# EasyEDA Pro project PRJ_Feeder.epro, board MainBoard
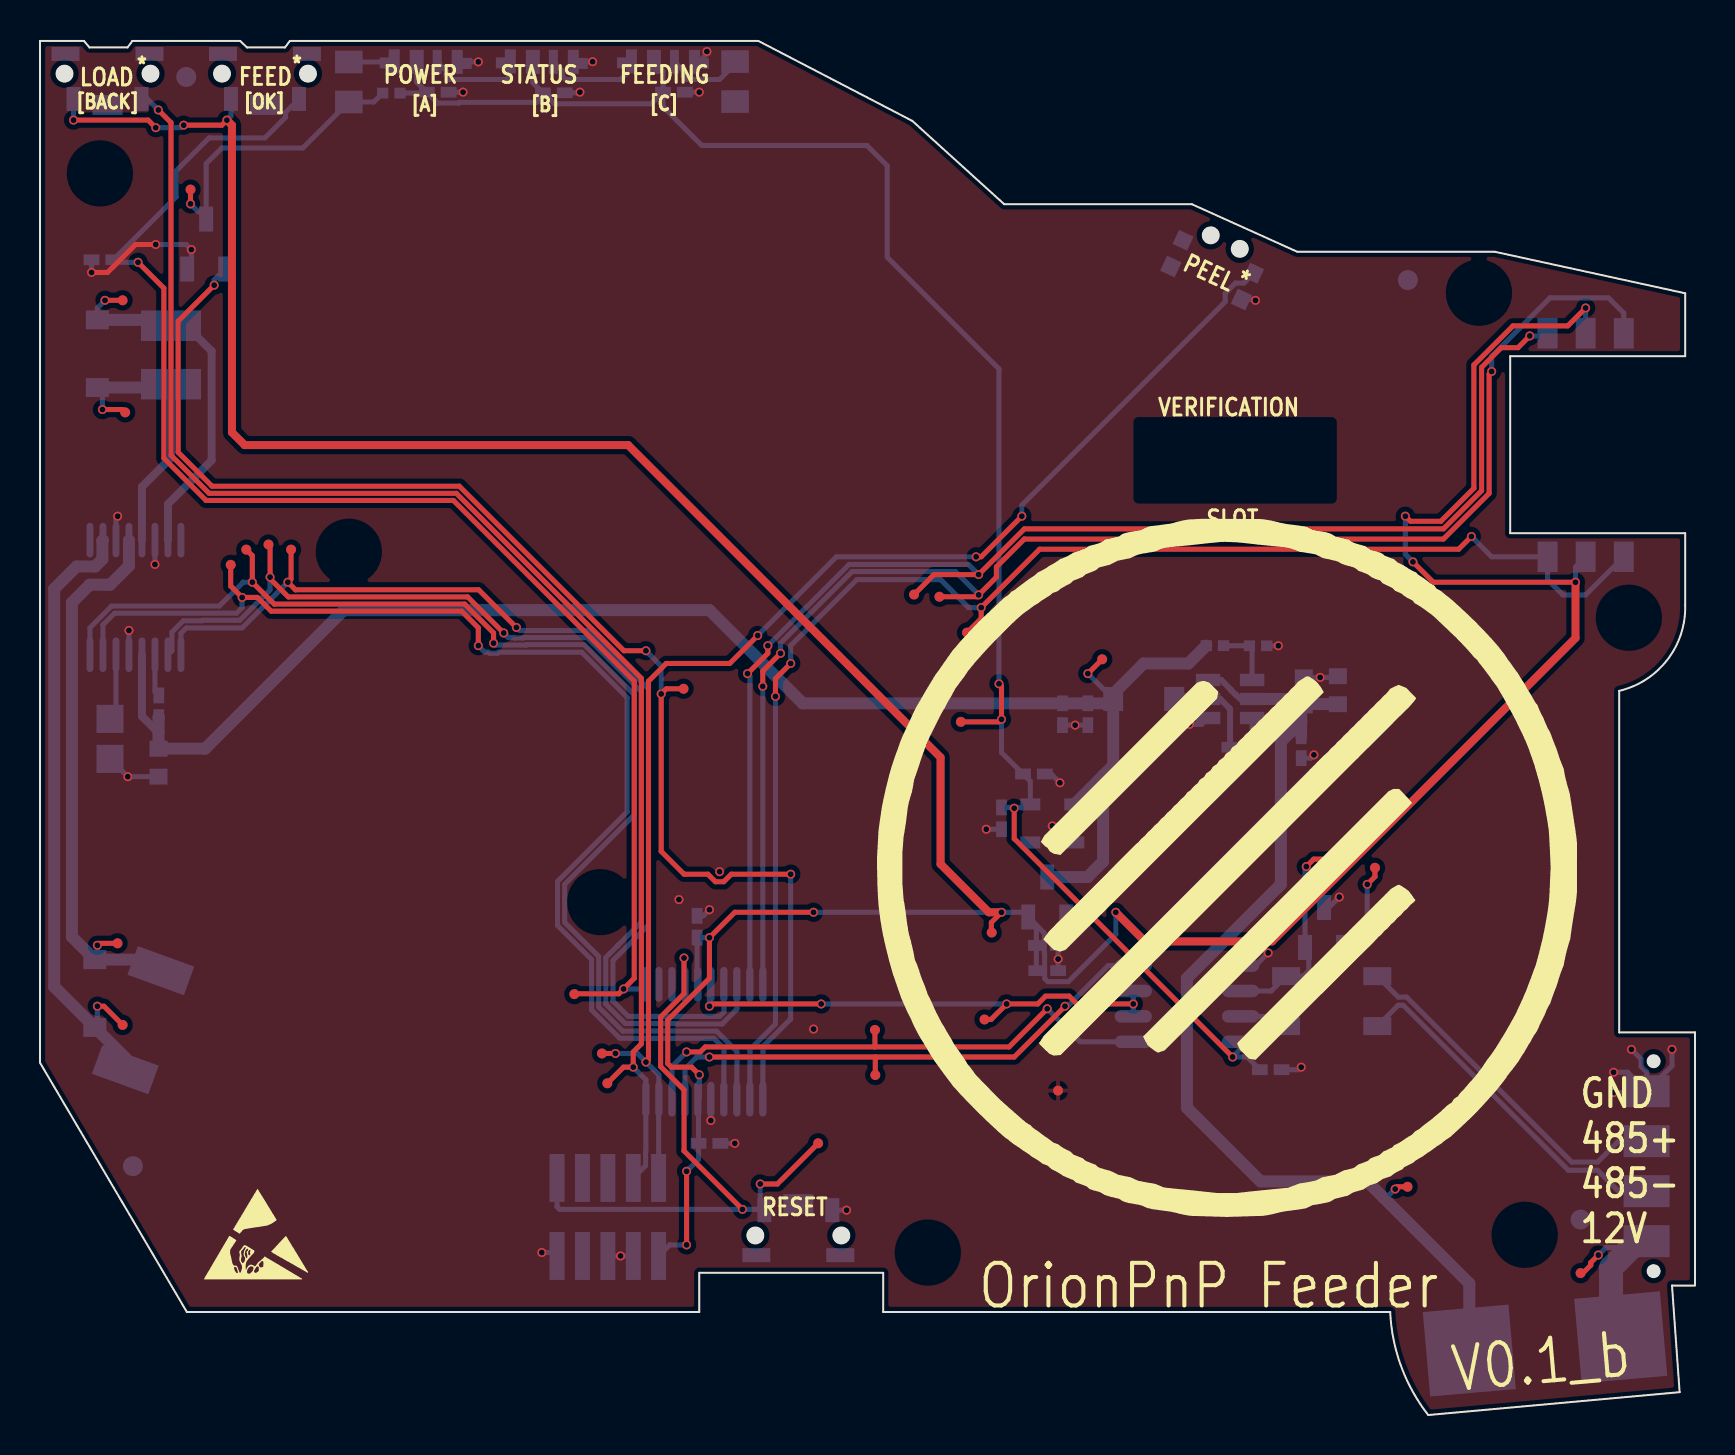
[diagram p10: board, top side]
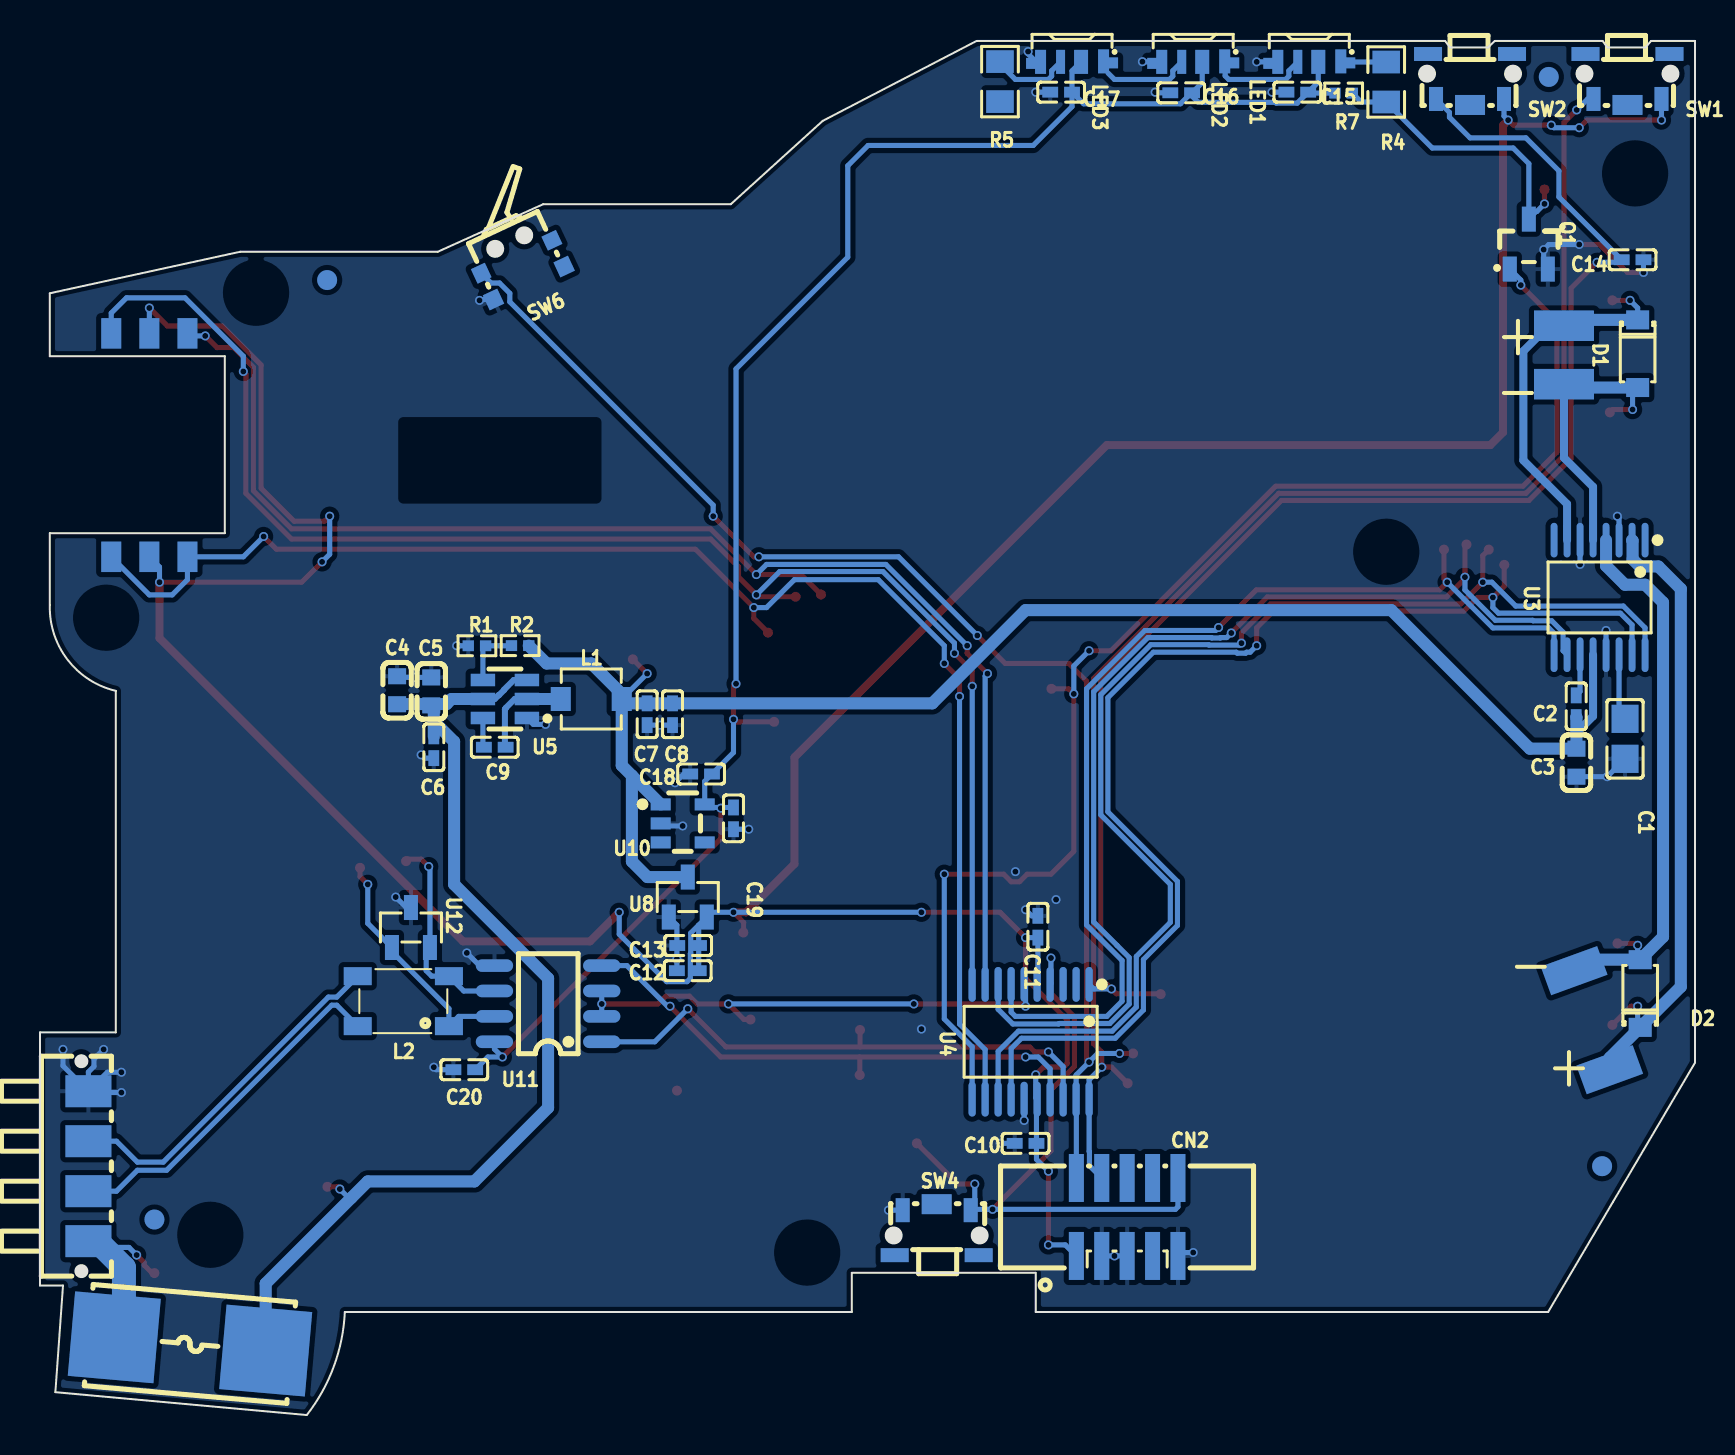
[diagram p11: board, bottom side, seen from below]

Outline 82.76 x 68.73 mm; copper layers: Top Layer, Bottom Layer. Coordinates in mm from the lower left corner of the outline.
Outline path: 0,68.73 0,17.62 4.09,10.67 7.34,5.15 32.97,5.15 32.97,7.11 42.16,7.11 42.16,5.15 67.52,5.15 arc(68.07,2.43) 69.42,0 81.99,1.14 81.61,6.48 82.76,6.48 82.76,19.14 78.97,19.14 78.97,36.22 arc(81.38,37.78) 82.27,40.51 82.27,44.11 73.52,44.11 73.52,52.96 82.27,52.96 82.27,56.11 72.74,58.18 62.87,58.18 57.6,60.56 48.22,60.56 43.62,64.73 35.92,68.73 12.49,68.73 12.25,68.4 10.35,68.4 10.01,68.73 4.62,68.73 4.38,68.4 2.48,68.4 2.2,68.73 0,68.73
Stack: Top Layer 0.035mm / Dielectric1 1.11mm FR4 er 4.5 / Bottom Layer 0.035mm

## Design rules (mm)
net 485-: DP1
net 485+: DP1
template: Custom Config
spacing copperThickness1oz (default): track to track 0.102, other pairs 0.152 to 0.3
spacing copperThickness2oz: track to track 0.203, other pairs 0.152 to 0.3
spacing PWR: track to track 0.3, other pairs 0.152 to 0.3
track width copperThickness1oz (default): min 0.127, default 0.254, max 2.54
track width copperThickness2oz: min 0.203, default 0.254, max 2.54
track width PWR: min 0.127, default 0.254, max 2.54
differential pair differentialPair (default): width min 0.127, default 0.254, max 2.54; gap min 0.152, default 0.152
via viaSize (default): diameter min 0.45, default 0.45, max 10; hole min 0.3, default 0.3, max 6.3
net 6V uses PWR
net DC_EN uses PWR
net DC_SW uses PWR
net VIN_RAW uses PWR
net M1- uses PWR
net M1+ uses PWR
net M2- uses PWR
net M2+ uses PWR

## Placement (name value [footprint] x y rotation side)
C1  2.2uF  [C0805]  3.5 33.82 90 bottom
C2  10nF  [C0402]  5.94 35.45 270 bottom
C3  10uF  [C0603]  5.93 32.63 270 bottom
C4  10uF  [C0603]  64.9 36.25 270 bottom
C5  10uF  [C0603]  63.19 36.2 270 bottom
C6  100nF  [C0402]  60.02 33.4 0 bottom
C7  22uF  [C0402]  52.4 35.05 90 bottom
C8  22uF  [C0402]  51.13 35.05 90 bottom
C9  100nF  [C0402]  63.07 33.4 270 bottom
C10  100nF  [C0402]  33.47 13.59 0 bottom
C11  100nF  [C0402]  32.86 24.42 90 bottom
C12  100nF  [C0402]  50.37 22.23 0 bottom
C13  4.7uF  [C0402]  50.35 23.48 180 bottom
C14  100nF  [C0402]  3.12 57.79 180 bottom
C15  100nF  [C0402]  19.89 66.17 0 bottom
C16  100nF  [C0402]  25.69 66.14 0 bottom
C17  100nF  [C0402]  31.7 66.17 0 bottom
C18  100nF  [C0402]  49.7 32.06 0 bottom
C19  4.7uF  [C0402]  48.08 29.85 90 bottom
C20  100nF  [C0402]  61.54 17.27 180 bottom
CN2  20021521-00010T1LF  [IDC-SMD_10P-P1.27_X1270WVS-2X05B-6TV01]  28.39 9.91 180 bottom
D1  1N4148W  [SOD-123_L2.8-W1.8-LS3.7-RD]  2.87 53.09 270 bottom
D2  1N4148W  [SOD-123_L2.8-W1.8-LS3.7-RD]  2.74 21.08 90 bottom
FH1  01550900M  [FUSE-SMD_L9.8-W5.0]  75.26 3.56 185 bottom
L1  1.5uH  [IND-SMD_L3.0-W3.0-LS3.65]  55.19 35.81 180 bottom
L2  ACT45B-510-2P-TL003  [IND-SMD_4P-L4.5-W3.2-TL]  64.59 20.7 0 bottom
LED1  SK6812SIDE-A-RVS  [LED-SMD_4P-L4.0-W1.6-L]  19.29 67.7 0 bottom
LED2  SK6812SIDE-A-RVS  [LED-SMD_4P-L4.0-W1.6-L]  25.09 67.7 0 bottom
LED3  SK6812SIDE-A-RVS  [LED-SMD_4P-L4.0-W1.6-L]  31.15 67.7 0 bottom
NOREF  -  [Pad_e195]  77.29 54.1 0 top
NOREF#2  -  [Pad_e190]  6.04 22.23 340 top
NOREF#3  -  [Pad_e192]  75.38 54.1 0 top
NOREF#4  -  [Pad_e194]  79.19 54.1 0 top
NOREF#5  -  [Pad_e198]  77.29 42.93 0 top
NOREF#6  -  [Pad_e196]  75.38 42.93 0 top
NOREF#7  -  [Pad_e188]  6.55 51.56 0 top
NOREF#8  -  [Pad_e191]  4.27 17.27 340 top
NOREF#9  -  [Pad_e187]  6.55 54.48 0 top
NOREF#10  -  [Pad_e197]  79.19 42.93 0 top
Q1  MDD3400  [SOT-23-3_L2.9-W1.5-P1.90-LS2.6-BR]  8.31 58.57 270 bottom
R1  10kΩ  [R0402]  60.91 38.48 180 bottom
R2  90.9kΩ  [R0402]  58.75 38.48 180 bottom
R4  470Ω  [R0805]  15.44 66.68 90 bottom
R5  470Ω  [R0805]  34.75 66.7 270 bottom
R7  10kΩ  [R0402]  17.57 66.12 180 bottom
SW1  1TS003A-2500-3500A-CT  [SW-SMD_1TS003A-XXXX-3500A-CT]  3.38 66.8 0 bottom
SW2  1TS003A-2500-3500A-CT  [SW-SMD_1TS003A-XXXX-3500A-CT]  11.25 66.8 0 bottom
SW4  1TS003A-2500-3500A-CT  [SW-SMD_1TS003A-XXXX-3500A-CT]  37.92 9.27 180 bottom
SW6  SPVN310101  [SW-SMD_SPVN310101]  58.62 57.28 155 bottom
TP1  -  [Test-Point-0.5mm]  50.91 16.23 0 top
TP2  -  [Test-Point-0.5mm]  47.59 24.13 0 top
TP3  -  [Test-Point-0.5mm]  77.04 7.1 0 top
TP4  -  [Test-Point-0.5mm]  68.38 11.42 0 top
TP5  -  [Test-Point-0.5mm]  46.05 34.67 0 top
TP6  -  [Test-Point-0.5mm]  53.11 37.8 0 top
TP8  -  [Test-Point-0.5mm]  28.1 18.08 0 top
TP9  -  [Test-Point-0.5mm]  38.91 13.59 0 top
TP10  -  [Test-Point-0.5mm]  26.72 21.05 0 top
TP11  -  [Test-Point-0.5mm]  28.37 16.59 0 top
TP12  -  [Test-Point-0.5mm]  66.76 27.37 0 top
TP13  -  [Test-Point-0.5mm]  64.45 27.71 0 top
TP14  -  [Test-Point-0.5mm]  41.75 19.26 0 top
TP15  -  [Test-Point-0.5mm]  47.23 19.78 0 top
TP16  -  [Test-Point-0.5mm]  41.77 17.01 0 top
TP17  -  [Test-Point-0.5mm]  32.18 36.33 0 top
TP18  -  [Test-Point-0.5mm]  7.53 61.3 0 top
TP19  -  [Test-Point-0.5mm]  4.13 55.76 0 top
TP20  -  [Test-Point-0.5mm]  4.26 50.15 0 top
TP21  -  [Test-Point-0.5mm]  3.88 23.59 0 top
TP22  -  [Test-Point-0.5mm]  4.13 19.51 0 top
TP23  -  [Test-Point-0.5mm]  10.31 43.29 270 top
TP24  -  [Test-Point-0.5mm]  9.54 42.52 270 top
TP25  -  [Test-Point-0.5mm]  11.43 43.54 270 top
TP26  -  [Test-Point-0.5mm]  12.55 43.29 270 top
TP27  -  [Test-Point-0.5mm]  44.98 40.93 0 top
TP28  -  [Test-Point-0.5mm]  43.71 41.04 0 top
TP29  -  [Test-Point-0.5mm]  46.36 39.13 0 top
U3  DRV8833PWR  [TSSOP-16_L5.0-W4.4-P0.65-LS6.4-BL]  4.77 40.89 0 bottom
U4  STM32F042F6P6TR  [TSSOP-20_L6.5-W4.4-P0.65-LS6.4-BL]  33.22 18.67 0 bottom
U5  TPS563249DDCR  [TSOT-23-6_L2.9-W1.6-P0.95-LS2.8-TL]  59.51 35.81 0 bottom
U8  XC6206P332MR  [SOT-23-3_L2.9-W1.3-P1.90-LS2.4-BR]  50.37 25.91 270 bottom
U9  YZ165615055F-04025-01  [CONN-SMD_4P-L11.0-W5.5-P2.50_YZ165615055F-04025-01]  80.34 12.45 90 bottom
U10  TPS7A2050PDBVR  [SOT-23-5_L2.9-W1.6-P0.95-LS2.8-BR]  50.62 29.59 0 bottom
U11  MAX1487EDTR(XBLW)  [SOP-8_L4.9-W3.9-P1.27-LS6.0-BL]  57.35 20.57 90 bottom
U12  PESD2CAN-ES  [SOT-23-3_L2.9-W1.3-P1.90-LS2.4-BR]  64.21 24.38 270 bottom
U13  -  [FIDUCIAL_1MM]  68.4 56.77 180 bottom
U13#2  -  [FIDUCIAL_1MM]  7.31 66.93 180 bottom
U13#3  -  [FIDUCIAL_1MM]  4.65 12.45 180 bottom
U13#4  -  [FIDUCIAL_1MM]  77.04 9.78 180 bottom

## Footprints (pads in the part's own frame, mm; a bottom-side part is the same pattern mirrored in y, then rotated)
C0402
  rect 0.79x0.54 smd: 1(-0.545,0) 2(0.545,0)
C0603
  rect 0.8x0.9 smd: 1(-0.7,0) 2(0.7,0)
C0805
  rect 1.41x1.35 smd: 1(-1,0) 2(1,0)
CONN-SMD_4P-L11.0-W5.5-P2.50_YZ165615055F-04025-01
  rect 1.6x2.3 smd: 1(-3.75,0) 2(-1.25,0) 3(1.25,0) 4(3.75,0)
FIDUCIAL_1MM
  round 1 smd: 1(0,0)
FUSE-SMD_L9.8-W5.0
  rect 4.3x4.24 smd: 1(-3.8,0) 2(3.8,0)
IDC-SMD_10P-P1.27_X1270WVS-2X05B-6TV01
  rect 0.75x2.4 smd: 1(-2.54,-1.95) 2(-2.54,1.95) 3(-1.27,-1.95) 4(-1.27,1.95) 5(0,-1.95) 6(0,1.95) 7(1.27,-1.95) 8(1.27,1.95) 9(2.54,-1.95) 10(2.54,1.95)
IND-SMD_4P-L4.5-W3.2-TL
  rect 1.4x0.9 smd: 1(-2.28,1.25) 2(-2.28,-1.25) 3(2.28,-1.25) 4(2.28,1.25)
IND-SMD_L3.0-W3.0-LS3.65
  rect 1x1.2 smd: 1(-1.524,0) 2(1.524,0)
LED-SMD_4P-L4.0-W1.6-L
  custom 1x1.2 smd: 1(-1.8,-0.013) 4(1.8,0.013)
  custom 0.7x1.2 smd: 2(-0.45,0.013)
  custom 0.45x1.2 smd: 3(0.575,0.013)
Pad_e187
  rect 3x1.524 smd far side: 1(0,0)
Pad_e188
  rect 3x1.524 smd far side: 2(0,0)
Pad_e190
  rect 3x1.524 smd far side: 2(0,0)
Pad_e191
  rect 3x1.524 smd far side: 1(0,0)
Pad_e192
  rect 1x1.524 smd far side: 1(0,0)
Pad_e194
  rect 1x1.524 smd far side: 1(0,0)
Pad_e195
  rect 1x1.524 smd far side: 1(0,0)
Pad_e196
  rect 1x1.524 smd far side: 1(0,0)
Pad_e197
  rect 1x1.524 smd far side: 1(0,0)
Pad_e198
  rect 1x1.524 smd far side: 1(0,0)
R0402
  rect 0.566x0.54 smd: 1(-0.433,0) 2(0.433,0)
R0805
  rect 1.133x1.377 smd: 1(-1,0) 2(1,0)
SOD-123_L2.8-W1.8-LS3.7-RD
  rect 0.95x1.15 smd: 1(-1.692,0) 2(1.692,0)
SOP-8_L4.9-W3.9-P1.27-LS6.0-BL
  oval 0.63x1.865 smd: 1(-1.905,-2.683) 2(-0.635,-2.683) 3(0.635,-2.683) 4(1.905,-2.683) 5(1.905,2.683) 6(0.635,2.683) 7(-0.635,2.683) 8(-1.905,2.683)
SOT-23-3_L2.9-W1.3-P1.90-LS2.4-BR
  rect 1.25x0.7 smd: 1(1,-0.95) 2(1,0.95) 3(-1,0)
SOT-23-3_L2.9-W1.5-P1.90-LS2.6-BR
  rect 1.25x0.7 smd: 1(1.25,-0.95) 2(1.25,0.95) 3(-1.25,0)
SOT-23-5_L2.9-W1.6-P0.95-LS2.8-BR
  rect 1x0.6 smd: 1(1.1,-0.95) 2(1.1,0) 3(1.1,0.95) 4(-1.1,0.95) 5(-1.1,-0.95)
SW-SMD_1TS003A-XXXX-3500A-CT
  rect 1.5x1 smd: 3(0,1.275)
  rect 1.4x0.7 smd: 4(-2.1,-1.275) 5(2.1,-1.275)
  rect 0.7x1.2 smd: A(1.7,0.975) B(-1.7,0.975)
SW-SMD_SPVN310101
  rect 0.77x0.8 smd: 1(-1.95,0.725)
  rect 0.8x0.83 smd: 2(-1.95,-0.725) 3(1.95,-0.725)
  rect 0.8x0.77 smd: 4(1.95,0.725)
Test-Point-0.5mm
  round 0.5 smd: 1(0,0)
TSOT-23-6_L2.9-W1.6-P0.95-LS2.8-TL
  rect 1.219x0.623 smd: 1(-1.1,0.95) 2(-1.1,0) 3(-1.1,-0.95) 4(1.1,-0.95) 5(1.1,0) 6(1.1,0.95)
TSSOP-16_L5.0-W4.4-P0.65-LS6.4-BL
  oval 0.343x1.732 smd: 1(-2.275,-2.866) 2(-1.625,-2.866) 3(-0.975,-2.866) 4(-0.325,-2.866) 5(0.325,-2.866) 6(0.975,-2.866) 7(1.625,-2.866) 8(2.275,-2.866) 9(2.275,2.866) 10(1.625,2.866) 11(0.975,2.866) 12(0.325,2.866) 13(-0.325,2.866) 14(-0.975,2.866) 15(-1.625,2.866) 16(-2.275,2.866)
TSSOP-20_L6.5-W4.4-P0.65-LS6.4-BL
  oval 0.364x1.742 smd: 1(-2.925,-2.871) 2(-2.275,-2.871) 3(-1.625,-2.871) 4(-0.975,-2.871) 5(-0.325,-2.871) 6(0.325,-2.871) 7(0.975,-2.871) 8(1.625,-2.871) 9(2.275,-2.871) 10(2.925,-2.871) 11(2.925,2.871) 12(2.275,2.871) 13(1.625,2.871) 14(0.975,2.871) 15(0.325,2.871) 16(-0.325,2.871) 17(-0.975,2.871) 18(-1.625,2.871) 19(-2.275,2.871) 20(-2.925,2.871)

## Nets
As in the schematic, except:
3V3: C10.1 C11.1 C12.1 C13.2 CN2.1 NOREF.1 NOREF#5.1 SW1.B SW2.B TP2.1 U4.5 U4.16 U8.2
IR_IN1: NOREF#3.1 TP28.1 U4.9
IR_IN2: NOREF#4.1 TP27.1 U4.10
IR_OUT: NOREF#6.1 NOREF#10.1 TP29.1 U4.12
M1+: D2.1 NOREF#8.1 TP22.1 U3.2
M1-: D2.2 NOREF#2.2 TP21.1 U3.4
M2+: D1.1 NOREF#9.1 TP19.1 U3.7
M2-: D1.2 NOREF#7.2 TP20.1 U3.5

Pads without a net: CN2 7 8; R5 2; SW1 3 4 5; SW2 3 4 5; SW4 3 4 5; SW6 3 4; U4 2 3; U10 3 4; U13 1; U13#2 1; U13#3 1; U13#4 1

## Via types
v1: diameter 0.45, hole 0.3, Top Layer to Bottom Layer, 112 vias

## Routing (per net, layer and track width the routed paths; a pad name or vN(x,y) marks a point on that pad's centre or on a via; arc(x,y) is an arc through that point)
3V3: length 192.6
  Top Layer w0.254: v1(7.19,64.52) 9.09,64.52 v1(9.34,64.77) ; v1(1.68,64.77) 5.41,64.77 v1(5.79,64.39) ; v1(38.68,25.15) 34.75,25.15 v1(33.47,23.88) 33.47,21.84 31.39,19.76 31.39,17.58 31.57,17.4 32.59,17.4 v1(32.97,17.02) ; TP2.1 47.57,24.15 47.57,24.64 v1(48.08,25.15) ; v1(68.65,42.67) 69.67,41.66 v1(76.78,41.66) ; v1(32.33,8.51) v1(32.33,12.19) ; v1(68.27,44.96) 68.53,44.7 70.05,44.7 71.7,46.36 71.7,52.52 73.66,54.48 76.4,54.48 v1(77.29,55.37)
  Top Layer w0.4: v1(53.79,25.15) 55.25,23.69 61.61,23.69 76.78,38.86 v1(76.78,41.66) ; v1(48.08,25.15) 47.44,25.15 45.03,27.56 45.03,32.89 29.41,48.51 10.23,48.51 9.6,49.15 9.6,64.52 v1(9.34,64.77)
  Bottom Layer w0.254: v1(5.79,64.39) 7.06,64.39 v1(7.19,64.52) ; SW1.B v1(1.68,64.77) ; NOREF#5.1 76.78,42.42 v1(76.78,41.66) ; 49.82,24.5 U8.2 49.18,25.15 v1(48.08,25.15) v1(38.68,25.15) ; 49.82,24.5 C12.1 ; 49.82,24.5 50.22,24.11 50.22,23.1 50.24,23.08 50.24,21.84 50.4,21.68 51.42,21.68 53.79,24.05 53.79,25.15 ; U4.5 32.86,21.58 C11.1 32.86,23.88 v1(33.47,23.88) ; v1(68.65,42.67) 68.27,43.05 v1(68.27,44.96) ; v1(32.97,17.02) 32.97,15.87 U4.16 32.93,15.76 C10.1 32.93,12.79 v1(32.33,12.19) ; NOREF.1 v1(77.29,55.37) ; v1(32.33,8.51) 31.49,8.51 30.94,7.96 ; SW2.B 9.55,64.98 v1(9.34,64.77)
5V: length 90.5
  Top Layer w0.254: v1(59.64,17.91) 48.72,28.83 v1(48.72,30.35) ; v1(47.95,36.58) 48.08,36.45 v1(48.08,34.8) 47.95,34.67 TP5.1
  Bottom Layer w0.254: C15.1 19.29,66.12 R7.1 ; C15.1 18.84,66.67 LED1.2 ; C15.1 19.89,65.62 20.94,65.62 20.98,65.66 24.84,65.66 25.15,65.97 C16.1 ; LED3.2 31.15,67.23 C17.1 ; C17.1 30.57,65.59 25.73,65.59 25.18,66.14 C16.1 ; C17.1 31.15,65.44 33.09,63.5 41.35,63.5 42.36,62.48 42.36,57.91 47.95,52.32 v1(47.95,36.58) ; v1(48.08,34.8) 48.08,33.14 C18.1 49.52,31.7 U10.5 49.37,30.39 C19.2 ; C16.1 24.64,66.64 LED2.2 ; U11.8 60.03,18.3 v1(59.64,17.91) 60.36,17.91 61,17.27
6V: length 80.7
  Top Layer w0.254: 53.11,37.8 v1(52.4,37.08)
  Bottom Layer w0.254: v1(52.4,37.08) L1.2
  Bottom Layer w0.4: U3.12 5.1,34.96 5.93,34.13
  Bottom Layer w0.6: U10.1 53.16,31.98 ; 53.16,31.98 53.16,27.69 52.38,26.91 U8.3 ; 53.16,31.98 53.67,32.49 L1.2 ; L1.2 53.45,35.6 C7.2 C8.2 38.14,35.6 33.47,40.26 15.19,40.26 8.26,33.33 C3.1 5.93,34.89 C2.2 ; L1.2 53.67,36.07 55.19,37.59 57.43,37.59 58.32,38.48
GND: length 47.8
  Top Layer w0.254: v1(5.79,58.55) 4.77,58.55 3.38,57.15 v1(2.58,57.15)
  Bottom Layer w0.254: v1(27.63,67.69) 27.62,67.68 LED2.4 ; C5.1 v1(64.01,36.9) 64.84,36.9 C4.1 ; 50.91,22.23 v1(50.91,22.81) 50.91,24.5 U8.1 ; U3.6 v1(5.75,42.55) ; U11.5 60.78,22.48 v1(61.41,23.11) ; C9.2 63.54,32.86 v1(63.7,33.02) ; U3.3 3.8,44.87 v1(3.88,44.96) ; v1(51,31.62) 50.56,32.06 C18.2 ; U5.1 58.09,34.54 v1(57.48,34.54) ; v1(64.97,25.91) 64.45,25.38 U12.3 ; C10.2 v1(34.75,13.59) ; LED1.4 v1(21.92,67.68) ; v1(5.79,58.55) 7.31,58.55 v1(7.57,58.29) 7.57,57.53 Q1.2 ; U9.4 79.39,17.15 v1(78.69,17.15) ; U9.4 81.61,17.47 v1(81.61,18.29) ; U9.4 80.34,17.16 80.06,17.44 80.06,17.81 v1(79.58,18.29) ; U9.4 80.27,16.13 v1(78.69,16.13) ; U10.2 51.59,29.46 v1(50.62,29.46) ; v1(60.78,55.75) 60.74,55.8 SW6.2 ; C20.1 62.94,17.27 v1(63.07,17.4) ; C3.2 v1(4.39,31.93) C1.1 ; U3.13 v1(4.45,39.24) ; C19.1 v1(47.32,29.3) ; C8.1 v1(51.76,34.51) C7.1 ; C11.2 33.17,24.97 v1(33.47,25.27) ; C16.2 26.97,66.14 v1(27,66.17) ; v1(25.09,8.13) 25.68,8.13 CN2.9 ; CN2.5 v1(29.03,7.96) CN2.3 ; C17.2 v1(32.97,66.17) ; U4.15 v1(33.55,14.73) ; v1(33.35,68.2) 33.35,68.08 LED3.4 ; C15.2 v1(21.16,66.17) ; SW4.B v1(40.33,10.25) ; C14.2 v1(2.58,57.15) ; R1.1 v1(61.92,38.48)
  vias: v1(31.95,25.78) v1(33.98,27.18) v1(38.68,19.3)
VIN_RAW: length 8.8
  Top Layer w0.254: 77.16,7.11 77.54,7.49 77.54,7.62 v1(77.92,8)
  Bottom Layer w0.254: 79.07,8.38 78.31,8.38 v1(77.92,8)
  Bottom Layer w1.2: 79.04,3.63 78.56,4.12 78.56,7.37 79.89,8.7 U9.1
VINT: length 3.3
  Bottom Layer w0.254: 4.01,34.82 3.8,35.03 U3.14
485+: length 17.8
  Bottom Layer w0.254: U9.3 78.93,13.7 77.89,12.65 76.59,12.65 68.34,20.9 67.92,20.9 L2.3
485-: length 17.8
  Bottom Layer w0.254: U9.2 78.93,11.2 77.89,12.24 76.43,12.24 68.17,20.5 67.92,20.5 L2.4
DC_BST: length 1.5
  Bottom Layer w0.254: C6.2 60.61,33.45 U5.6
DC_EN: length 52.8
  Top Layer w0.254: v1(67.76,11.3) 67.88,11.42 TP4.1
  Bottom Layer w0.254: 67.19,10.86 67.32,10.86 v1(67.76,11.3)
  Bottom Layer w0.3: U5.5 60.02,35.81 59.83,36 59.81,36 59.55,36.27 59.55,36.28 59.07,36.76 U5.3
  Bottom Layer w0.6: C9.1 63.07,34.7 ; 63.07,34.7 63.07,35.37 C5.2 ; 63.07,34.7 62.05,33.68 62.05,26.54 57.35,21.84 57.35,15.37 61.03,11.68 66.37,11.68 71.47,6.58 71.47,3.23 ; U5.5 62.18,35.81 62.43,35.56 64.89,35.56 C4.2
DC_FB: length 3.1
  Bottom Layer w0.254: R2.1 59.19,38.48 R1.2 60.61,38.34 U5.4
DC_SW: length 4.9
  Bottom Layer w0.3: 59.47,33.4 59.51,33.44 59.51,35.31 59.47,35.34 59.47,35.36 59.02,35.81 U5.2
  Bottom Layer w0.6: L1.1 U5.2
DI: length 27
  Top Layer w0.254: v1(51.25,20.45) 48.72,17.91 41.79,17.91 ; TP16.1 41.77,17.89 41.79,17.91 ; 41.79,17.91 v1(33.47,17.91)
  Bottom Layer w0.254: v1(33.47,17.91) 32.84,17.91 32.25,17.31 U4.17 ; U11.4 53.41,22.48 51.38,20.45 v1(51.25,20.45)
IN_1+: length 61.9
  Top Layer w0.254: v1(22.68,38.61) 22.68,39.12 21.23,40.56 11.71,40.56 v1(10.61,41.66) 10.61,42.99 TP23.1
  Bottom Layer w0.254: v1(10.61,41.66) 10.16,41.66 8.96,40.46 3.58,40.46 2.5,39.38 U3.16 ; v1(22.68,38.61) 22.78,38.51 24.31,38.51 24.33,38.53 27.21,38.53 29.72,36.03 29.72,30.02 26.24,26.54 26.24,24.64 27.94,22.94 27.94,20.41 29.14,19.2 33.83,19.2 34.85,18.19 U4.13
IN_1-: length 60.8
  Top Layer w0.254: v1(21.92,38.48) 21.92,39.37 21.09,40.21 11.56,40.21 10.87,40.89 v1(10.11,40.89) 9.54,41.46 TP24.1
  Bottom Layer w0.254: U4.14 34.2,18.33 33.68,18.85 28.99,18.85 27.58,20.26 27.58,22.79 25.88,24.49 25.88,26.69 29.36,30.17 29.36,35.88 27.08,38.15 22.94,38.15 22.89,38.1 22.47,38.1 22.42,38.15 22.24,38.15 v1(21.92,38.48) ; v1(10.11,40.89) 10.11,40.39 9.83,40.11 3.73,40.11 3.15,39.52 U3.15
IN_2+: length 53.1
  Top Layer w0.254: TP26.1 12.55,41.82 v1(12.39,41.66) 12.77,41.28 21.94,41.28 v1(23.82,39.39)
  Bottom Layer w0.254: v1(23.82,39.39) 23.97,39.24 27.51,39.24 30.43,36.32 30.43,24.51 28.65,22.73 28.65,20.7 29.41,19.94 33.98,19.94 34.2,20.15 U4.7 ; U3.9 7.05,39.11 7.31,39.37 10.11,39.37 v1(12.39,41.66)
IN_2-: length 55.2
  Top Layer w0.254: v1(23.19,39.12) 21.38,40.92 12.42,40.92 11.5,41.83 v1(11.5,41.91) 11.5,43.46 TP25.1
  Bottom Layer w0.254: U4.8 34.85,20.29 34.11,19.56 31.82,19.56 31.8,19.58 29.26,19.58 28.29,20.55 28.29,22.88 28.9,23.49 28.9,23.5 30.07,24.66 30.07,36.17 27.36,38.89 24.18,38.89 24.16,38.87 23.74,38.87 23.72,38.89 23.42,38.89 v1(23.19,39.12) ; U3.10 6.6,38.23 6.6,39.16 7.17,39.73 8.1,39.73 8.12,39.75 9.98,39.75 11.5,41.27 v1(11.5,41.91)
IR_IN1: length 70.6
  Top Layer w0.254: TP28.1 44.7,42.04 v1(46.94,42.04) 49.22,44.32 70.18,44.32 72.09,46.23 72.09,52.41 73.07,53.39 73.91,53.39 v1(74.5,53.98) ; v1(35.38,37.08) 36.4,38.1 v1(36.4,38.48)
  Bottom Layer w0.254: v1(35.38,37.08) 35.5,36.97 U4.9 ; NOREF#3.1 75.26,53.98 v1(74.5,53.98) ; v1(46.94,42.04) 46.43,42.55 40.46,42.55 v1(36.4,38.48)
IR_IN2: length 75.3
  Top Layer w0.254: v1(72.59,52.2) 72.46,52.07 72.46,46.1 70.18,43.82 49.22,43.82 47.83,42.42 47.83,41.91 v1(46.94,41.02) 46.84,40.93 TP27.1 ; v1(37.03,38.1) 36.14,37.21 v1(36.14,36.45)
  Bottom Layer w0.254: v1(46.94,41.02) 45.77,42.19 40.61,42.19 37.03,38.61 v1(37.03,38.1) ; v1(72.59,52.2) 72.59,52.96 75.51,55.88 78.43,55.88 79.19,55.12 NOREF#4.1 ; v1(36.14,36.45) 36.14,21.54 U4.10
IR_OUT: length 72.8
  Top Layer w0.254: v1(71.57,43.94) 70.94,43.31 49.98,43.31 v1(47.06,40.39) 47.06,39.84 TP29.1 ; v1(37.54,37.59) 36.78,36.83 v1(36.78,35.94)
  Bottom Layer w0.254: v1(37.54,37.59) 37.54,38.48 40.84,41.78 45.03,41.78 46.43,40.39 v1(47.06,40.39) ; U4.12 35.5,18.28 36.78,19.56 v1(36.78,35.94) ; NOREF#10.1 77.29,41.02 76.15,41.02 75.38,41.78 NOREF#6.1 72.59,42.93 v1(71.57,43.94)
M1+: length 32.3
  Top Layer w0.254: TP22.1 3.2,20.45 v1(2.87,20.45)
  Bottom Layer w0.254: v1(2.87,20.45) 2.87,19.52 D2.1
  Bottom Layer w0.6: U3.2 3.12,43.73 3.12,42.81 2.76,42.44 1.83,42.44 0.71,41.32 0.71,21.42 D2.1 4.27,17.87 NOREF#8.1
M1-: length 28.6
  Top Layer w0.254: v1(2.87,23.5) 2.97,23.59 TP21.1
  Bottom Layer w0.254: D2.2 2.87,22.9 v1(2.87,23.5)
  Bottom Layer w0.6: NOREF#2.2 5.49,22.77 D2.2 1.6,23.92 1.6,40.64 2.49,41.53 3.5,41.53 4.45,42.47 U3.4
M2+: length 18.7
  Top Layer w0.254: TP19.1 v1(3.25,55.76)
  Bottom Layer w0.254: v1(3.25,55.76) 2.87,55.37 D1.1
  Bottom Layer w0.4: NOREF#9.1 7.31,54.48 8.58,53.21 8.58,47.75 6.4,45.57 U3.7
  Bottom Layer w0.6: NOREF#9.1 6.26,54.78 D1.1
M2-: length 14.6
  Top Layer w0.254: v1(3.12,50.29) 4.12,50.29 TP20.1
  Bottom Layer w0.254: D1.2 3.12,51.14 v1(3.12,50.29)
  Bottom Layer w0.4: NOREF#7.2 6.55,47.88 5.1,46.43 U3.5
  Bottom Layer w0.6: D1.2 6.38,51.39 NOREF#7.2
PA13: length 66.8
  Top Layer w0.254: v1(46.81,42.93) 47.06,42.93 v1(49.1,44.96) ; TP8.1 v1(28.78,18.08) ; v1(30.3,17.65) 30.43,17.78 30.43,36.7 31.32,37.59 34.49,37.59 v1(35.89,38.99)
  Bottom Layer w0.254: 30.94,11.86 30.94,15.79 U4.19 30.95,17.01 v1(30.3,17.65) 29.87,18.08 v1(28.78,18.08) ; v1(49.1,44.96) 49.1,45.51 59.26,55.68 59.26,56.11 59.78,56.62 60.2,56.62 SW6.1 ; v1(35.89,38.99) 39.82,42.93 v1(46.81,42.93)
PA14: length 74.1
  Top Layer w0.254: v1(5.92,65.28) 6.55,64.64 6.55,48.01 8.46,46.1 20.82,46.1 30.07,36.85 30.07,18.57 29.66,18.16 v1(29.66,17.4) 29.18,17.4 TP11.1
  Bottom Layer w0.254: SW1.A 5.37,65.83 v1(5.92,65.28) ; CN2.4 30.28,12.47 30.28,13.17 30.3,13.19 U4.20 30.3,16.77 v1(29.66,17.4)
RE/DE: length 25.4
  Top Layer w0.254: v1(33.47,20.45) 33.59,20.56 v1(39.06,20.56) ; v1(54.67,20.56) 51.85,20.56 51.46,20.95 50.28,20.95 49.89,20.56 v1(48.33,20.56) 47.56,19.78 TP15.1
  Bottom Layer w0.254: U4.6 33.47,21.47 v1(33.47,20.45) ; U11.3 v1(54.67,20.56) U11.2 ; v1(48.33,20.56) v1(39.06,20.56)
RGB: length 68.3
  Top Layer w0.254: v1(8.71,56.52) 6.91,54.71 6.91,48.15 8.6,46.46 20.97,46.46 29.2,38.23 v1(30.3,38.23) ; v1(37.54,27.05) 34.57,27.05 34.19,26.67 33.77,26.67 33.4,27.05 32.2,27.05 31.06,28.19 v1(31.06,36.07) 31.32,36.33 TP17.1
  Bottom Layer w0.254: Q1.1 8.71,56.77 v1(8.71,56.52) ; v1(31.06,36.07) 31.06,37.47 v1(30.3,38.23) ; v1(37.54,27.05) 37.54,19.81 36.15,18.42 U4.11
RO: length 27.4
  Top Layer w0.254: v1(50.37,20.32) 48.46,18.41 33.27,18.41 33.02,18.16 v1(32.33,18.16) ; TP14.1 41.75,18.41
  Bottom Layer w0.254: U11.1 52.02,18.67 v1(50.37,20.32) ; v1(32.33,18.16) 31.6,17.43 U4.18
RST: length 33
  Top Layer w0.254: v1(36.01,11.56) 36.88,11.56 TP9.1 ; v1(32.2,22.86) 32.2,21.08 31.03,19.91 31.03,17.43 32.2,16.26 32.2,13.21 v1(35.13,10.29)
  Bottom Layer w0.254: U4.4 32.2,21.58 v1(32.2,22.86) ; v1(36.01,11.56) 36.01,10.45 36.18,10.29 ; CN2.10 25.85,10.41 25.98,10.29 v1(35.13,10.29) 36.18,10.29 ; 36.18,10.29 SW4.A
SW2: length 72.7
  Top Layer w0.254: v1(4.9,57.66) 6.19,56.36 6.19,47.85 8.3,45.75 20.67,45.75 29.72,36.7 29.72,21.84 v1(29.18,21.31) 28.94,21.07 26.74,21.07
  Bottom Layer w0.254: v1(4.9,57.66) 3.79,57.66 C14.1 6.8,60.92 6.8,62.23 8.46,63.88 11.25,63.88 12.28,64.91 12.28,65.16 SW2.A ; v1(29.18,21.31) 30.07,21.31 U4.1
VCP: length 2.1
  Bottom Layer w0.254: U3.11 5.75,36.19 C2.1
$2N2838: length 5
  Bottom Layer w0.254: LED2.1 23.49,67.51 23.49,66.98 23.31,66.8 20.47,66.8 20.31,66.97 20.31,67.24 LED1.3
$2N2847: length 4.3
  Bottom Layer w0.254: 25.67,67.68 26.11,67.24 26.11,66.97 26.28,66.8 29.03,66.8 29.35,67.12
$2N2968: length 4
  Bottom Layer w0.254: LED3.3 32.17,67.24 32.17,66.97 32.33,66.8 33.98,66.8 34.75,67.57 R5.1
$2N2973: length 2.1
  Bottom Layer w0.254: LED1.1 17.46,67.68 R4.2
$2N2985: length 14.9
  Top Layer w0.254: TP18.1 v1(7.53,60.58)
  Bottom Layer w0.254: 8.31,59.84 8.31,62.59 9.09,63.37 13.14,63.37 R4.1 16.69,65.68 R7.2 ; 8.31,59.84 Q1.3 ; 8.31,59.84 7.95,60.2 7.91,60.2 v1(7.53,60.58)
$2N3597: length 10.5
  Top Layer w0.254: TP13.1 64.36,27.8 63.69,27.8 v1(63.32,27.43)
  Bottom Layer w0.254: v1(63.32,27.43) 63.26,27.37 U12.2 63.45,23.2 63.45,22.23 63.17,21.95 L2.2 61.57,21.21 U11.6
$2N3600: length 12.2
  Top Layer w0.254: TP12.1 66.76,26.93 v1(66.37,26.54)
  Bottom Layer w0.254: v1(66.37,26.54) 66.37,24.59 U12.1 65.16,23.18 62.31,20.33 L2.1 61.82,19.94 U11.7

## Copper pours and planes (outline as drawn; the poured copper is in the pictures)
GND on Top Layer: -0.05,69.98 82.75,69.98 82.75,-0.13 -0.05,-0.13
GND on Bottom Layer: -0.05,69.85 82.62,69.85 82.62,-0.13 -0.05,-0.13

## Text on the board
Bottom Silkscreen Layer: + | -
Top Silkscreen Layer: [BACK] | * | [OK] | [A] | [B] | [C] | LOAD | FEED | POWER | STATUS | FEEDING | RESET | VERIFICATION | SLOT | PEEL | GND / 485+ / 485- / 12V | OrionPnP Feeder | V0.1_b
